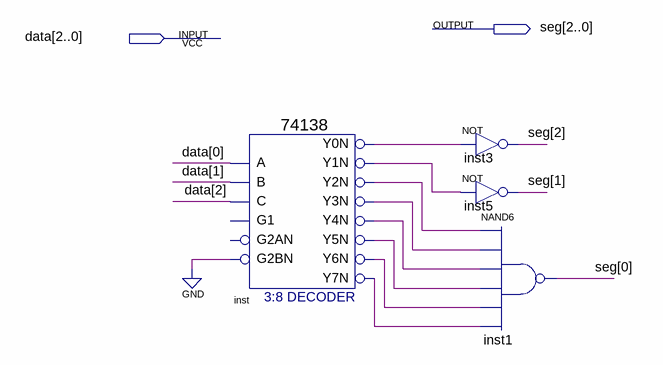
[diagram p0: schematic sheet]
// Quartus schematic decoder3_8.bdf as structural Verilog: 4 symbols, 2 pins
module decoder3_8 (
  input  [2:0] data,
  output [2:0] seg
);

  wire inst_y0n, inst_y1n, inst_y2n, inst_y3n, inst_y4n, inst_y5n, inst_y6n, inst_y7n;

  \74138  inst (
    .A(data[0]), .B(data[1]), .C(data[2]), .G2BN(1'b0), .Y0N(inst_y0n), .Y1N(inst_y1n), .Y2N(inst_y2n),
    .Y3N(inst_y3n), .Y4N(inst_y4n), .Y5N(inst_y5n), .Y6N(inst_y6n), .Y7N(inst_y7n));  // open: G1, G2AN
  not inst3 (seg[2], inst_y0n);
  not inst5 (seg[1], inst_y1n);
  nand inst1 (seg[0], inst_y2n, inst_y3n, inst_y4n, inst_y5n, inst_y6n, inst_y7n);
endmodule
